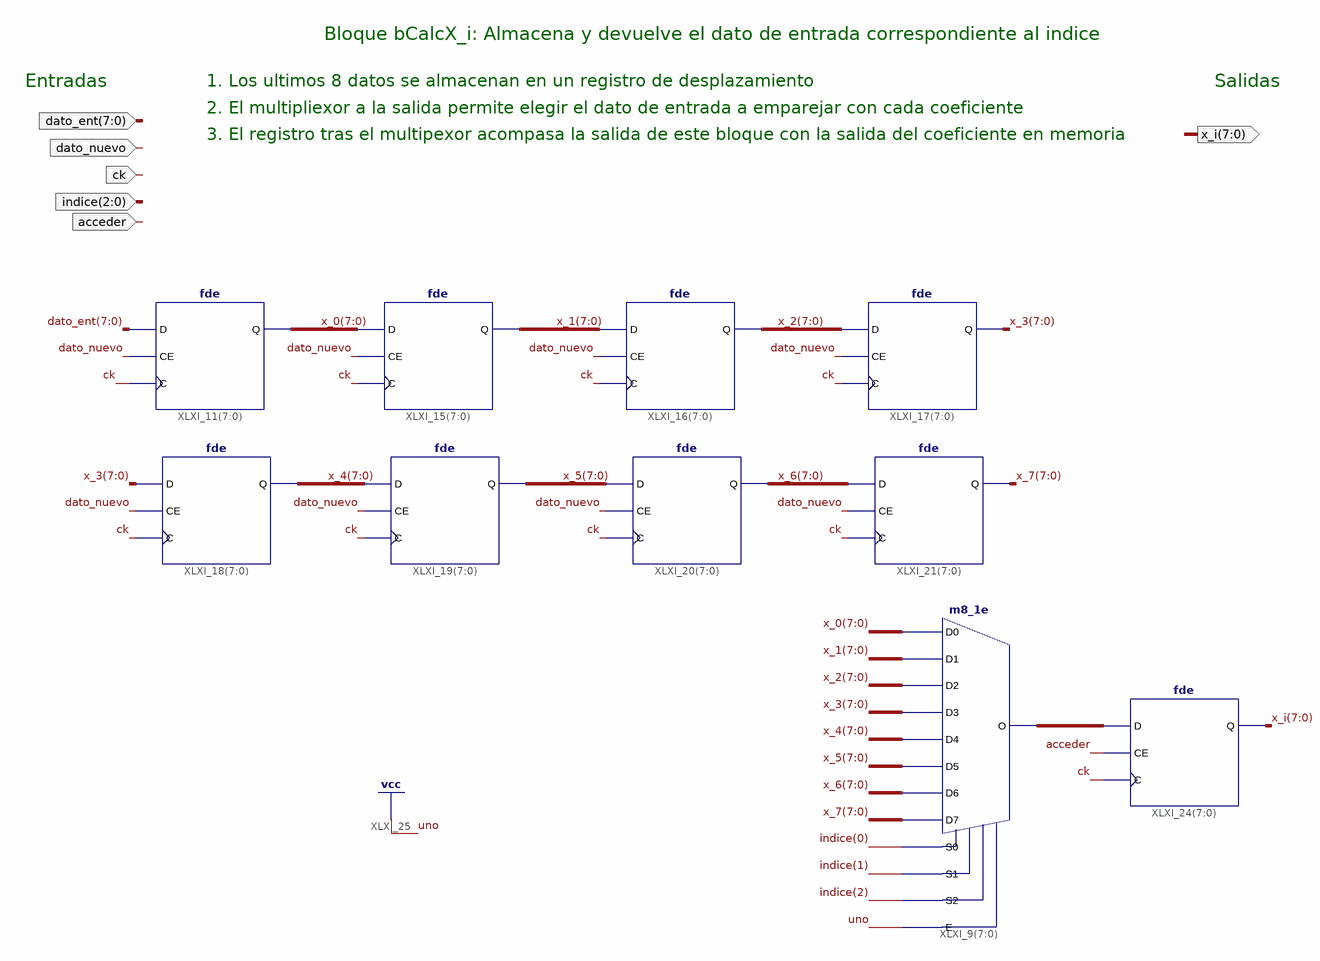
[diagram p0: schematic sheet 1]
// Xilinx ISE schematic bCalcX_i.sch (spartan6) as structural Verilog: 10 symbols, 6 ports
module bCalcX_i (
  input  dato_nuevo,
  input  ck,
  input  [7:0] dato_ent,
  input  [2:0] indice,
  input  acceder,
  output [7:0] x_i
);

  wire [7:0] x_0, x_1, x_2, x_3, x_4, x_5, x_6, x_7, XLXN_1;

  fde XLXI_18[7:0] (.C(ck), .CE(dato_nuevo), .D(x_3), .Q(x_4));
  fde XLXI_19[7:0] (.C(ck), .CE(dato_nuevo), .D(x_4), .Q(x_5));
  fde XLXI_20[7:0] (.C(ck), .CE(dato_nuevo), .D(x_5), .Q(x_6));
  fde XLXI_21[7:0] (.C(ck), .CE(dato_nuevo), .D(x_6), .Q(x_7));
  fde XLXI_11[7:0] (.C(ck), .CE(dato_nuevo), .D(dato_ent), .Q(x_0));
  fde XLXI_15[7:0] (.C(ck), .CE(dato_nuevo), .D(x_0), .Q(x_1));
  fde XLXI_16[7:0] (.C(ck), .CE(dato_nuevo), .D(x_1), .Q(x_2));
  fde XLXI_17[7:0] (.C(ck), .CE(dato_nuevo), .D(x_2), .Q(x_3));
  fde XLXI_24[7:0] (.C(ck), .CE(acceder), .D(XLXN_1), .Q(x_i));
  m8_1e XLXI_9[7:0] (
    .D0(x_0), .D1(x_1), .D2(x_2), .D3(x_3), .D4(x_4), .D5(x_5), .D6(x_6), .D7(x_7), .E(1'b1), .S0(indice[0]),
    .S1(indice[1]), .S2(indice[2]), .O(XLXN_1));

  // Notes on the sheet:
  //   Bloque bCalcX_i: Almacena y devuelve el dato de entrada correspondiente al indice
  //   Entradas
  //   1. Los ultimos 8 datos se almacenan en un registro de desplazamiento
  //   Salidas
  //   2. El multipliexor a la salida permite elegir el dato de entrada a emparejar con cada coeficiente
  //   3. El registro tras el multipexor acompasa la salida de este bloque con la salida del coeficiente en memoria
endmodule
